# Altium schematic sheet Motor driver Schematic.SchDoc
size A; DocumentNumber: 5; SheetNumber: 5; SheetTotal: 11
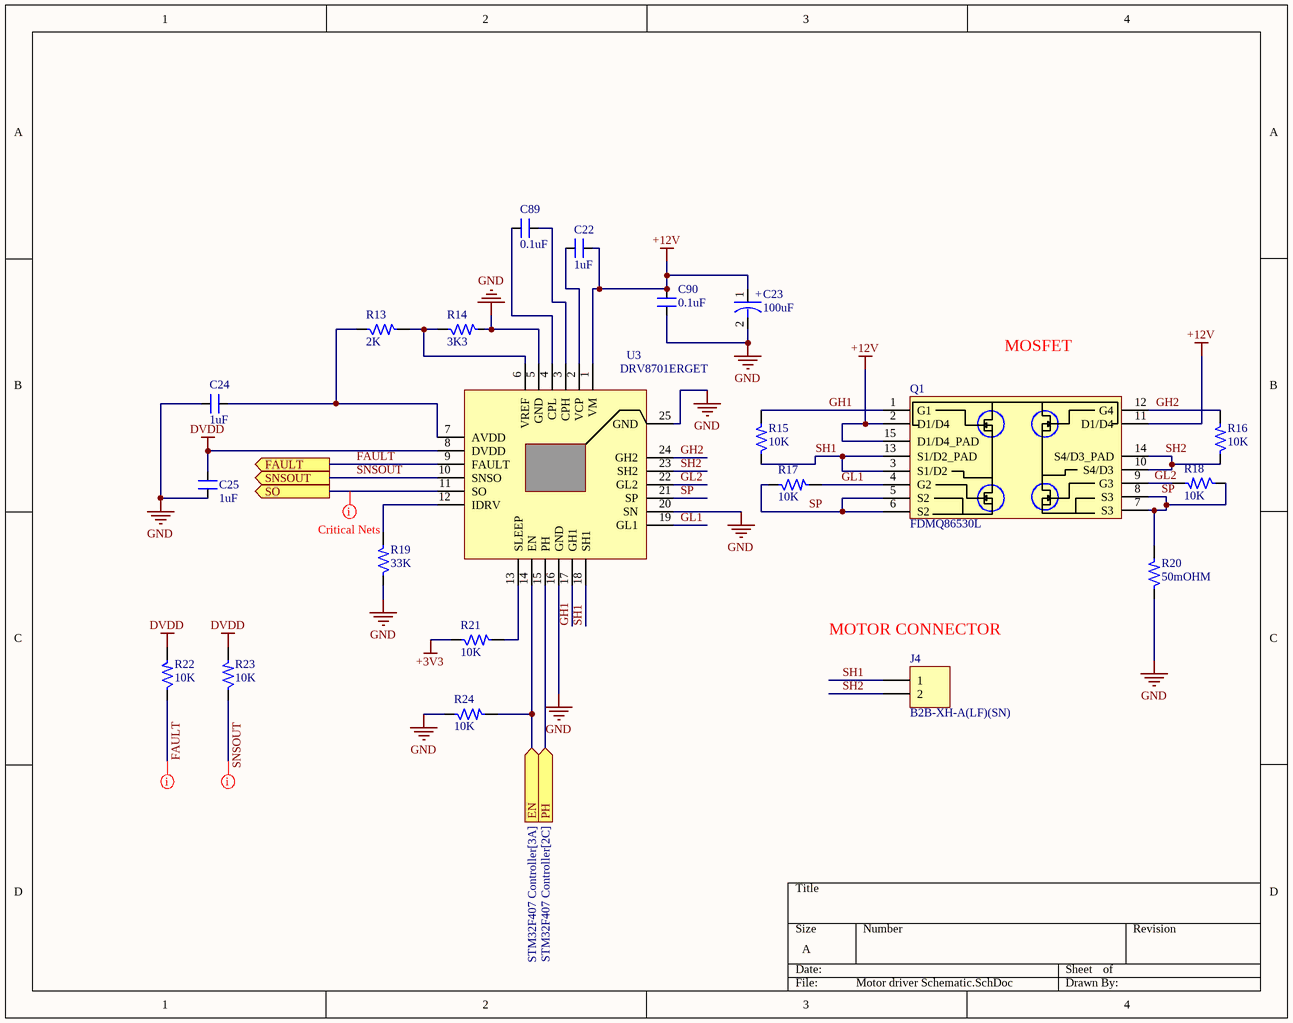
[diagram p0: Motor driver Schematic.SchDoc]

## Parts
C22  1uF  [CAP_0805]
C23  100uF  [ACAP_P236_D305_H303_RAD]
C24  1uF  [CAP_0805]
C25  1uF  [CAP_0805]
C89  0.1uF  [CAP_0805]
C90  0.1uF  [CAP_0805]
J4  B2B-XH-A(LF)(SN)  [CON2_100_B2B-XH-A_TH_ST]
Q1  FDMQ86530L  [DFN5045-12_33_212_27X15_SMD_1]
R13  2K  [RES_0603]
R14  3K3  [RES_0603]
R15  10K  [RES_0603]
R16  10K  [RES_0603]
R17  10K  [RES_0603]
R18  10K  [RES_0603]
R19  33K  [RES_0805]
R20  50mOHM  [RES_2512]
R21  10K  [RES_0603]
R22  10K  [RES_0603]
R23  10K  [RES_0603]
R24  10K  [RES_0603]
U3  DRV8701ERGET  [VFQFN24_19.6_196_12X32_SMD_1]

## Ports
EN (in, see STM32F407 Controller[3A]), FAULT (out, see STM32F407 Controller[3B]), PH (in, see STM32F407 Controller[2C]), SNSOUT (out, see STM32F407 Controller[3B]), SO (out, see STM32F407 Controller[2A])

## Nets
+3V3: R21.1
+12V: C22.2 C23.1 C90.2 Q1.2(D1/D4) Q1.11(D1/D4) Q1.15(D1/D4_PAD) U3.1(VM)
DVDD: C25.1 R22.2 R23.2 U3.8(DVDD)
GND: C23.2 C24.1 C25.2 C90.1 R14.2 R19.1 R20.1 R24.1 U3.5(GND) U3.16(GND) U3.20(SN) U3.25(GND)
EN: R24.2 U3.14(EN) ; port EN
FAULT: R22.1 U3.9(FAULT) ; port FAULT
GH1: Q1.1(G1) R15.2 U3.17(GH1)
GH2: Q1.12(G4) R16.2 U3.24(GH2)
GL1: Q1.4(G2) R17.2 U3.19(GL1)
GL2: Q1.9(G3) R18.2 U3.22(GL2)
PH: U3.15(PH) ; port PH
SH1: J4.1 Q1.3(S1/D2) Q1.13(S1/D2_PAD) R15.1 U3.18(SH1)
SH2: J4.2 Q1.10(S4/D3) Q1.14(S4/D3_PAD) R16.1 U3.23(SH2)
SNSOUT: R23.1 U3.10(SNSO) ; port SNSOUT
SO: U3.11(SO) ; port SO
SP: Q1.5(S2) Q1.6(S2) Q1.7(S3) Q1.8(S3) R17.1 R18.1 R20.2 U3.21(SP)
NetC22_1: C22.1 U3.2(VCP)
NetC24_2: C24.2 R13.1 U3.7(AVDD)
NetC89_1: C89.1 U3.4(CPL)
NetC89_2: C89.2 U3.3(CPH)
NetR13_2: R13.2 R14.1 U3.6(VREF)
NetR19_2: R19.2 U3.12(IDRV)
NetR21_2: R21.2 U3.13(SLEEP)

## Layout directives
net class Critical Nets: FAULT, SNSOUT, SO

## Notes on the sheet
- MOSFET
- (near J4) MOTOR CONNECTOR
- (in symbol CAP-P_100uF-25V-20%-RAD) +

## Library data of the parts
C22 C24 C25 = CAP_1uF-50V-5%-0805: 1µF ±5% 50V Ceramic Capacitor X7R 0805 (2012 Metric); Manufacturer: Samsung; Manufacturer Part Number: CC0805JKX7R9BB105; Alternate Part Number-1: 0805F105M500NT; Case/Package: 0805; Supplier-1: SIRICOM; Supplier Part Number-1: CL21B105KBFNNNE
C23 = CAP-P_100uF-25V-20%-RAD: 100µF 25V Aluminum Electrolytic Capacitors Radial, Can - SMD 1000 Hrs @ 105°C; Manufacturer: Nichicon; Manufacturer Part Number: UWT1E101MCL1GS; Alternate Part Number-1: NA; Case/Package: Radial-SMD; Supplier-1: SP ROAD; Supplier Part Number-1: UWT1E101MCL1GS
C89 C90 = CAP_0.1uF-50V-5%-0805: 0.1µF ±5% 50V Ceramic Capacitor X7R 0805 (2012 Metric); Manufacturer: AVX Corporation; Manufacturer Part Number: 08055C104JAT4A; Alternate Part Number-1: 0805B104M500; Case/Package: 0805; Supplier-1: SIRICOM; Supplier Part Number-1: 0805B104J500CT
J4 = CON-PLG_2X1-100-ST-TH: 2 Pins, 1 Row 2.54mm Pitch, Straight Connector, male; Manufacturer: JST; Mating Part Number: XHP-2; Crimp Part Number: ASXHSXH22K51; Alternate Part Number-1: NA; Manufacturer Part Number: B2B-XH-A(LF)(SN); Case/Package: TH-CON; Supplier-1: SP ROAD; Supplier Part Number-1: B2B-XH-A(LF)(SN)
Q1 = MOSFET-N_60V-8A-V-DFN5045-12: Mosfet Array 4 N-Channel 8A (Ta) Surface Mount V-DFN5045-12; Manufacturer: ON Semiconductor; Alternate Part Number-1: NA; Manufacturer Part Number: FDMQ86530L; Case/Package: DFN5045-12; Supplier-1: Arrow; Supplier Part Number-1: FDMQ86530L
R13 = RES_2K-0.125W-1%-0603: 2 kOhms ±1% 0.125W, 1/8W Chip Resistor 0603 (1608 Metric) Anti-Sulfur, Moisture Resistant Thin Film; Manufacturer: Stackpole Electronics; Manufacturer Part Number: RNCP0603FTD2K00; Alternate Part Number-1: NA; Case/Package: 0603; Supplier-1: SIRICOM; Supplier Part Number-1: WR06X2001FTL
R14 = RES_3.3K-0.1W-1%-0603: 3.3 kOhms ±1% 0.1W, 1/10W Chip Resistor 0603 (1608 Metric) Automotive AEC-Q200 Thick Film; Manufacturer: Wilson; Manufacturer Part Number: WR06X3301FTL; Alternate Part Number-1: 0603WAF3301T5E; Case/Package: 0603; Supplier-1: SIRICOM; Supplier Part Number-1: WR06X3301FTL
R15-R18 R21-R24 = RES_10K-0.1W-1%-0603: 10 kOhms ±1% 0.1W, 1/10W Chip Resistor 0603 (1608 Metric) Automotive AEC-Q200 Thick Film; Manufacturer: Walsin; Manufacturer Part Number: WR06X1002FTL; Alternate Part Number-1: 0603WAJ0103T5E; Case/Package: 0603; Supplier-1: SIRICOM; Supplier Part Number-1: WR06X1002FTL
R19 = RES_33K-0.125W-1%-0805: Thick Film Resistors - SMD 33KOhms 1/8W 150V33 kOhms ±1% 0.125W, 1/8W Chip Resistor 0805 (2012 Metric) Thick Film; Manufacturer: Vishay BCcomponents; Manufacturer Part Number: CRG0805F33K; Alternate Part Number-1: NA; Case/Package: 0805; Supplier-1: SIRICOM; Supplier Part Number-1: WR08X3302FTL
R20 = RES_50mOhm-2W-1%-2512: 50 mOhms ±1% 2W Chip Resistor 2512 (6432 Metric) Automotive AEC-Q200, Current Sense, Moisture Resistant Metal Element; Manufacturer: Yageo; Manufacturer Part Number: PA2512FKF7W0R05E; Alternate Part Number-1: PMR100HZPFU5L00; Case/Package: 2512; Supplier-1: SIRICOM; Supplier Part Number-1: LR2512-22R060F1
U3 = IC_DRV8701ERGET: Motor Driver Power MOSFET Parallel 24-VQFN (4x4); Manufacturer: Texas Instruments; Alternate Part Number-1: NA; Manufacturer Part Number: DRV8701ERGET; Case/Package: VFQFN24; Supplier-1: ARROW; Supplier Part Number-1: DRV8701ERGET